# Altium schematic sheet 环境检测.SchDoc
size A4
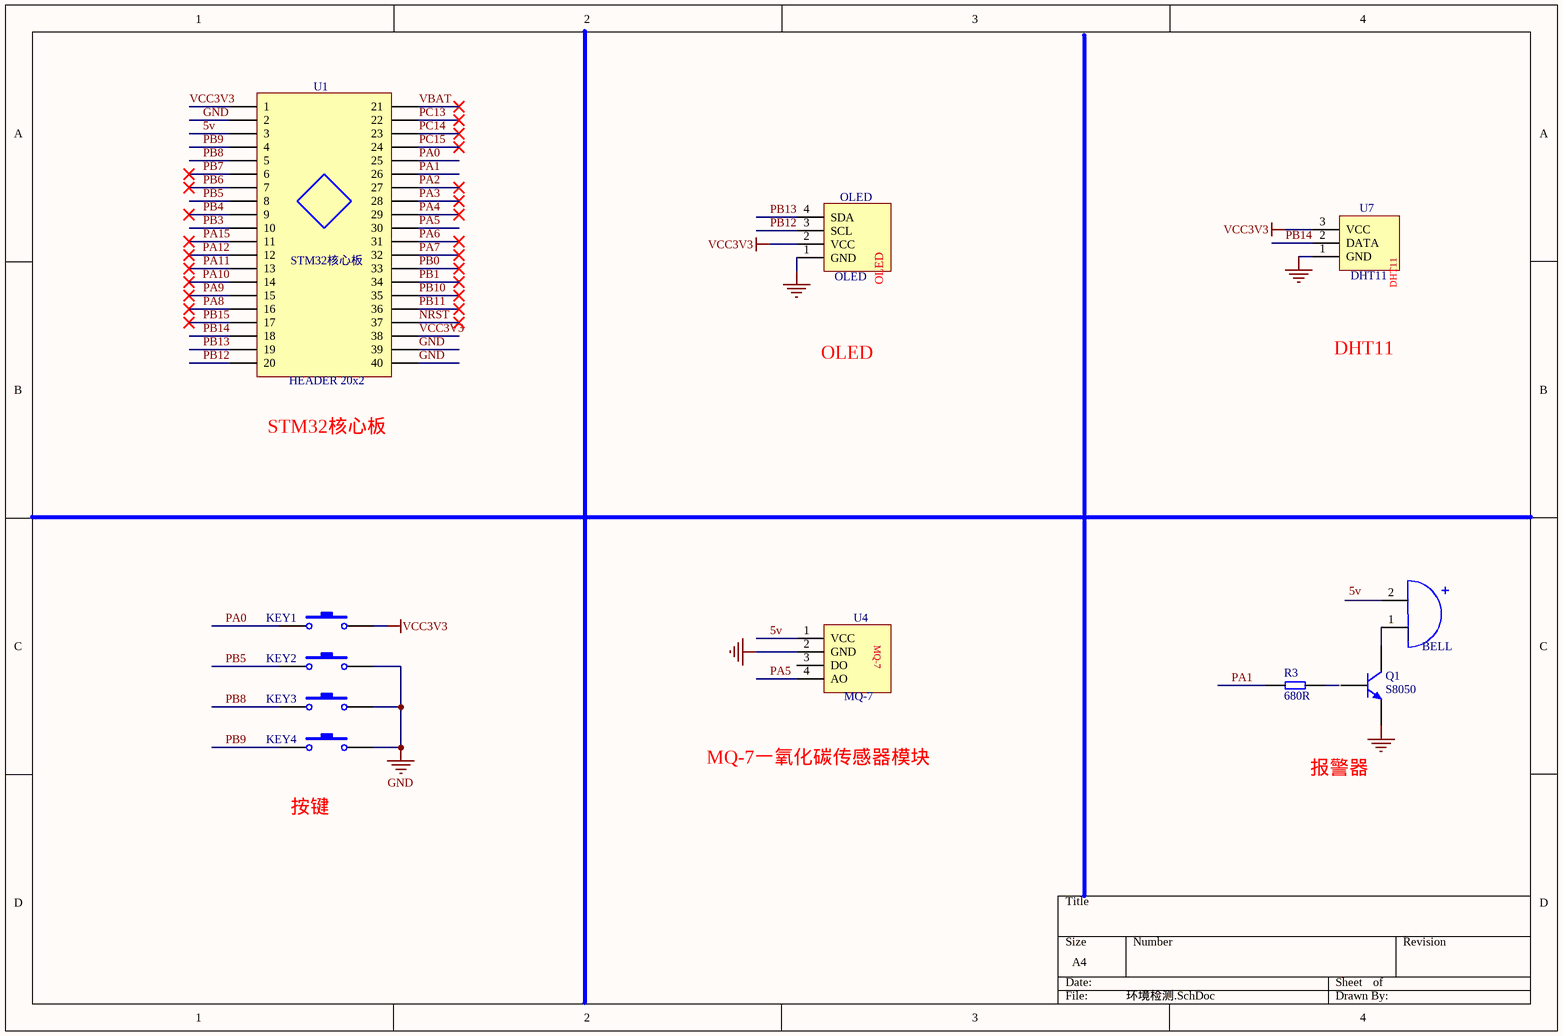
[diagram p0: 环境检测.SchDoc]

## Parts
BELL  BELL  [BELL]  (value not drawn)
KEY1  SW-PB  [SW-PB]  (value not drawn)
KEY2  SW-PB  [SW-PB]  (value not drawn)
KEY3  SW-PB  [SW-PB]  (value not drawn)
KEY4  SW-PB  [SW-PB]  (value not drawn)
OLED  OLED  [OLED]
Q1  S8050  [TO-92A]
R3  680R  [RES]
U1  HEADER 20x2  [HEADER 20x2]
U4  MQ-7  [MQ]
U7  DHT11  [DHT11]

## Nets
GND: KEY2.2 KEY3.2 KEY4.2 OLED.1(GND) Q1.1(E) U1.2 U1.39 U1.40 U4.2(GND) U7.1(GND)
VCC3V3: KEY1.2 OLED.2(VCC) U1.1 U1.38 U7.3(VCC)
5v: U1.3 U4.1(VCC)
NRST: U1.37
PA0: KEY1.1 U1.25
PA1: R3.1 U1.26
PA2: U1.27
PA3: U1.28
PA4: U1.29
PA5: U1.30 U4.4(AO)
PA6: U1.31
PA7: U1.32
PA8: U1.16
PA9: U1.15
PA10: U1.14
PA11: U1.13
PA12: U1.12
PA15: U1.11
PB0: U1.33
PB1: U1.34
PB3: U1.10
PB4: U1.9
PB5: KEY2.1 U1.8
PB6: U1.7
PB7: U1.6
PB8: KEY3.1 U1.5
PB9: KEY4.1 U1.4
PB10: U1.35
PB11: U1.36
PB12: OLED.3(SCL) U1.20
PB13: OLED.4(SDA) U1.19
PB14: U1.18 U7.2(DATA)
PB15: U1.17
PC13: U1.22
PC14: U1.23
PC15: U1.24
VBAT: U1.21
NetBELL_1: BELL.1 Q1.3(C)

Not connected (* = marked no-connect by the designer): BELL 2; Q1 2(B); R3 2; U4 3(DO)

## Notes on the sheet
- OLED
- DHT11
- STM32核心板
- MQ-7一氧化碳传感器模块
- 报警器
- (near KEY4) 按键
- Labels drawn without touching a wire or pin: 5v
- (in symbol stm32核心板) STM32核心板

## Library data of the parts
Q1 = 2N3904: NPN General Purpose Amplifier; Published: 8-Jun-2000; LatestRevisionDate: 15-Jan-2003; LatestRevisionNote: PCB Footprint 'BCY-W3/D4.7' replaced; DatasheetVersion: 1997; PackageVersion: Sep-1998; PackageReference: TO-92A; Publisher: Altium Limited; PackageDescription: TO, Flat Index; 3 In-Line, Axial Leads; Body Dia. 4.5mm; Leads 0.51 x 0.48 mm (max); ComponentLink1Description: Manufacturer Link; ComponentLink1URL: http://www.fairchildsemi.com/; ComponentLink2Description: Datasheet; ComponentLink2URL: http://www.fairchildsemi.com/ds/2N%2F2N3904.pdf
R3 = RES
U1 = stm32核心板